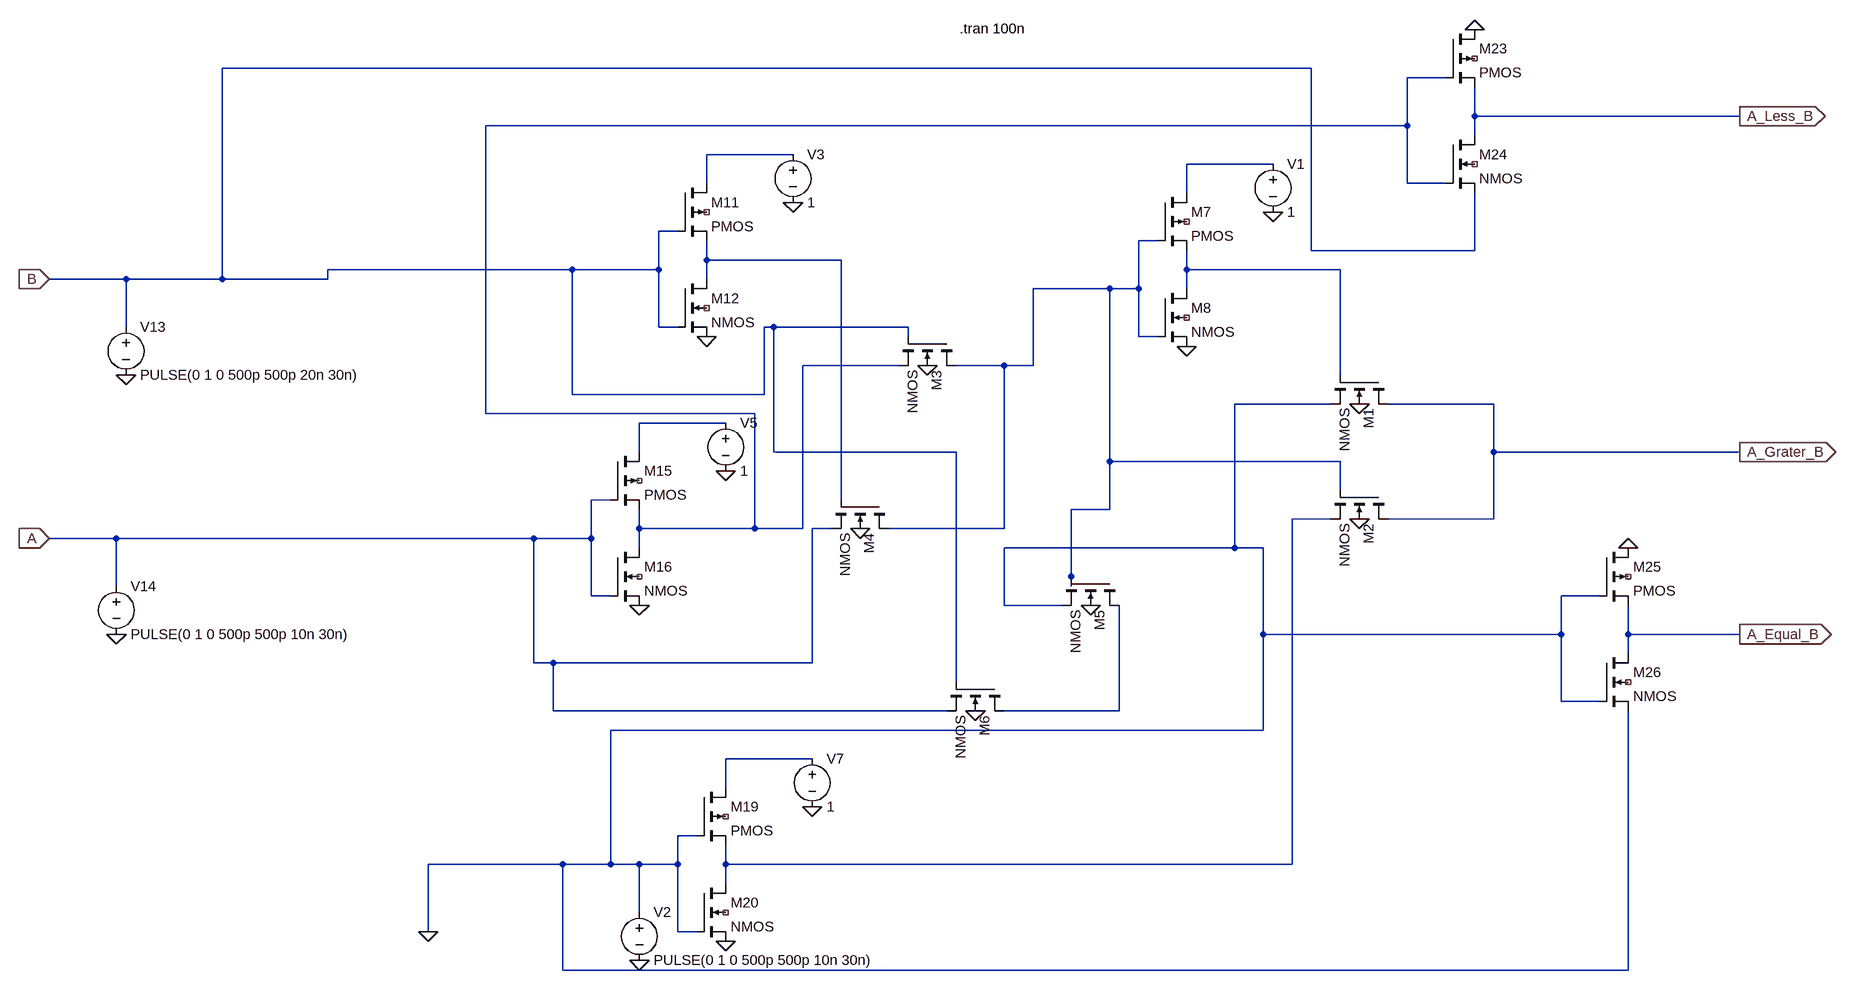
[diagram p0: schematic Comparatornew.asc]
Comparatornew.asc, the LTspice schematic file:
Version 4
SHEET 1 1676 980
WIRE 496 -608 -1328 -608
WIRE 720 -592 656 -592
WIRE 768 -528 768 -576
WIRE 1520 -528 768 -528
WIRE 656 -512 656 -592
WIRE 656 -512 -880 -512
WIRE 768 -496 768 -528
WIRE -368 -464 -512 -464
WIRE 432 -448 288 -448
WIRE -512 -416 -512 -464
WIRE 656 -416 656 -512
WIRE 720 -416 656 -416
WIRE 288 -400 288 -448
WIRE -560 -336 -592 -336
WIRE 240 -320 208 -320
WIRE 496 -304 496 -608
WIRE 768 -304 768 -400
WIRE 768 -304 496 -304
WIRE -512 -288 -512 -320
WIRE -288 -288 -512 -288
WIRE -736 -272 -1152 -272
WIRE -592 -272 -592 -336
WIRE -592 -272 -736 -272
WIRE 288 -272 288 -304
WIRE 544 -272 288 -272
WIRE -1488 -256 -1616 -256
WIRE -1328 -256 -1328 -608
WIRE -1328 -256 -1488 -256
WIRE -1152 -256 -1152 -272
WIRE -1152 -256 -1328 -256
WIRE -512 -256 -512 -288
WIRE 160 -240 32 -240
WIRE 208 -240 208 -320
WIRE 208 -240 160 -240
WIRE 288 -240 288 -272
WIRE -1488 -176 -1488 -256
WIRE -592 -176 -592 -272
WIRE -560 -176 -592 -176
WIRE -400 -176 -416 -176
WIRE -176 -176 -400 -176
WIRE -176 -160 -176 -176
WIRE 208 -160 208 -240
WIRE 240 -160 208 -160
WIRE -192 -112 -352 -112
WIRE -16 -112 -96 -112
WIRE 32 -112 32 -240
WIRE 32 -112 -16 -112
WIRE 544 -96 544 -272
WIRE -736 -64 -736 -272
WIRE -416 -64 -416 -176
WIRE -416 -64 -736 -64
WIRE 528 -48 368 -48
WIRE 800 -48 624 -48
WIRE -880 -32 -880 -512
WIRE -432 -32 -880 -32
WIRE -480 -16 -624 -16
WIRE -624 32 -624 -16
WIRE -400 32 -400 -176
WIRE -96 32 -400 32
WIRE 800 32 800 -48
WIRE 1520 32 800 32
WIRE 160 48 160 -240
WIRE 544 48 160 48
WIRE 544 96 544 48
WIRE -672 112 -704 112
WIRE -288 112 -288 -288
WIRE 160 128 160 48
WIRE 160 128 96 128
WIRE 528 144 464 144
WIRE 800 144 800 32
WIRE 800 144 624 144
WIRE -624 160 -624 128
WIRE -432 160 -432 -32
WIRE -432 160 -624 160
WIRE -352 160 -352 -112
WIRE -352 160 -432 160
WIRE -304 160 -336 160
WIRE -16 160 -16 -112
WIRE -16 160 -208 160
WIRE -1504 176 -1616 176
WIRE -800 176 -1504 176
WIRE -704 176 -704 112
WIRE -704 176 -800 176
WIRE -624 192 -624 160
WIRE 368 192 368 -48
WIRE 368 192 -16 192
WIRE 416 192 368 192
WIRE 96 240 96 128
WIRE -1504 256 -1504 176
WIRE 96 256 96 240
WIRE -704 272 -704 176
WIRE -672 272 -704 272
WIRE 976 272 912 272
WIRE -16 288 -16 192
WIRE 80 288 -16 288
WIRE 416 336 416 192
WIRE 912 336 912 272
WIRE 912 336 416 336
WIRE 1024 336 1024 288
WIRE 1520 336 1024 336
WIRE 1024 368 1024 336
WIRE -800 384 -800 176
WIRE -768 384 -800 384
WIRE -336 384 -336 160
WIRE -336 384 -768 384
WIRE -96 416 -96 32
WIRE 912 448 912 336
WIRE 976 448 912 448
WIRE -768 464 -768 384
WIRE -112 464 -768 464
WIRE 176 464 176 288
WIRE 176 464 -16 464
WIRE 416 496 416 336
WIRE 416 496 -672 496
WIRE -336 544 -480 544
WIRE -480 592 -480 544
WIRE -528 672 -560 672
WIRE -752 720 -976 720
WIRE -672 720 -672 496
WIRE -672 720 -752 720
WIRE -624 720 -672 720
WIRE -560 720 -560 672
WIRE -560 720 -624 720
WIRE -480 720 -480 688
WIRE 464 720 464 144
WIRE 464 720 -480 720
WIRE -480 752 -480 720
WIRE -624 800 -624 720
WIRE -976 832 -976 720
WIRE -560 832 -560 720
WIRE -528 832 -560 832
WIRE -752 896 -752 720
WIRE 1024 896 1024 464
WIRE 1024 896 -752 896
FLAG 288 -144 0
FLAG 432 -368 0
FLAG -512 -160 0
FLAG -368 -384 0
FLAG -624 288 0
FLAG -480 64 0
FLAG -480 848 0
FLAG -336 624 0
FLAG 576 -48 0
FLAG 576 144 0
FLAG 128 288 0
FLAG -64 464 0
FLAG -256 160 0
FLAG -144 -112 0
FLAG 1024 192 0
FLAG 768 -672 0
FLAG -1616 176 A
IOPIN -1616 176 In
FLAG -1616 -256 B
IOPIN -1616 -256 In
FLAG 1520 -528 A_Less_B
IOPIN 1520 -528 Out
FLAG 1520 32 A_Grater_B
IOPIN 1520 32 Out
FLAG 1520 336 A_Equal_B
IOPIN 1520 336 Out
FLAG -1488 -96 0
FLAG -1504 336 0
FLAG -976 832 0
FLAG -624 880 0
SYMBOL nmos4 624 -96 R90
SYMATTR InstName M1
SYMBOL nmos4 624 96 R90
SYMATTR InstName M2
SYMBOL nmos4 -96 -160 R90
SYMATTR InstName M3
SYMBOL nmos4 -208 112 R90
SYMATTR InstName M4
SYMBOL nmos4 176 240 R90
SYMATTR InstName M5
SYMBOL nmos4 -16 416 R90
SYMATTR InstName M6
SYMBOL pmos4 240 -400 R0
SYMATTR InstName M7
SYMBOL nmos4 240 -240 R0
SYMATTR InstName M8
SYMBOL voltage 432 -464 R0
WINDOW 123 0 0 Left 0
WINDOW 39 0 0 Left 0
SYMATTR InstName V1
SYMATTR Value 1
SYMBOL pmos4 -560 -416 R0
SYMATTR InstName M11
SYMBOL nmos4 -560 -256 R0
SYMATTR InstName M12
SYMBOL voltage -368 -480 R0
WINDOW 123 0 0 Left 0
WINDOW 39 0 0 Left 0
SYMATTR InstName V3
SYMATTR Value 1
SYMBOL pmos4 -672 32 R0
SYMATTR InstName M15
SYMBOL nmos4 -672 192 R0
SYMATTR InstName M16
SYMBOL voltage -480 -32 R0
WINDOW 123 0 0 Left 0
WINDOW 39 0 0 Left 0
SYMATTR InstName V5
SYMATTR Value 1
SYMBOL pmos4 -528 592 R0
SYMATTR InstName M19
SYMBOL nmos4 -528 752 R0
SYMATTR InstName M20
SYMBOL voltage -336 528 R0
WINDOW 123 0 0 Left 0
WINDOW 39 0 0 Left 0
SYMATTR InstName V7
SYMATTR Value 1
SYMBOL pmos4 720 -672 R0
SYMATTR InstName M23
SYMBOL nmos4 720 -496 R0
SYMATTR InstName M24
SYMBOL pmos4 976 192 R0
SYMATTR InstName M25
SYMBOL nmos4 976 368 R0
SYMATTR InstName M26
SYMBOL voltage -1488 -192 R0
WINDOW 123 0 0 Left 0
WINDOW 39 0 0 Left 0
SYMATTR InstName V13
SYMATTR Value PULSE(0 1 0 500p 500p 20n 30n)
SYMBOL voltage -1504 240 R0
WINDOW 123 0 0 Left 0
WINDOW 39 0 0 Left 0
SYMATTR InstName V14
SYMATTR Value PULSE(0 1 0 500p 500p 10n 30n)
SYMBOL voltage -624 784 R0
WINDOW 123 0 0 Left 0
WINDOW 39 0 0 Left 0
SYMATTR InstName V2
SYMATTR Value PULSE(0 1 0 500p 500p 10n 30n)
TEXT -90 -674 Left 2 !.tran 100n

The netlist it stands for:
* Comparatornew.asc
M1 A_Grater_B N006 0 0 NMOS
M2 A_Grater_B N004 N008 0 NMOS
M3 N004 B N001 0 NMOS
M4 N004 N005 A 0 NMOS
M5 N009 N004 0 0 NMOS
M6 N009 B A 0 NMOS
M7 N003 N004 N006 NC_01 PMOS
M8 N006 N004 0 NC_02 NMOS
V1 N003 0 1
M11 N002 B N005 NC_03 PMOS
M12 N005 B 0 NC_04 NMOS
V3 N002 0 1
M15 N007 A N001 NC_05 PMOS
M16 N001 A 0 NC_06 NMOS
V5 N007 0 1
M19 N010 0 N008 NC_07 PMOS
M20 N008 0 0 NC_08 NMOS
V7 N010 0 1
M23 0 N001 A_Less_B NC_09 PMOS
M24 A_Less_B N001 B NC_10 NMOS
M25 0 0 A_Equal_B NC_11 PMOS
M26 A_Equal_B 0 0 NC_12 NMOS
V13 B 0 PULSE(0 1 0 500p 500p 20n 30n)
V14 A 0 PULSE(0 1 0 500p 500p 10n 30n)
V2 0 0 PULSE(0 1 0 500p 500p 10n 30n)
.model NMOS NMOS
.model PMOS PMOS
.lib standard.mos
.tran 100n
.backanno
.end